# EAGLE design version02 (EAGLE 4.16)
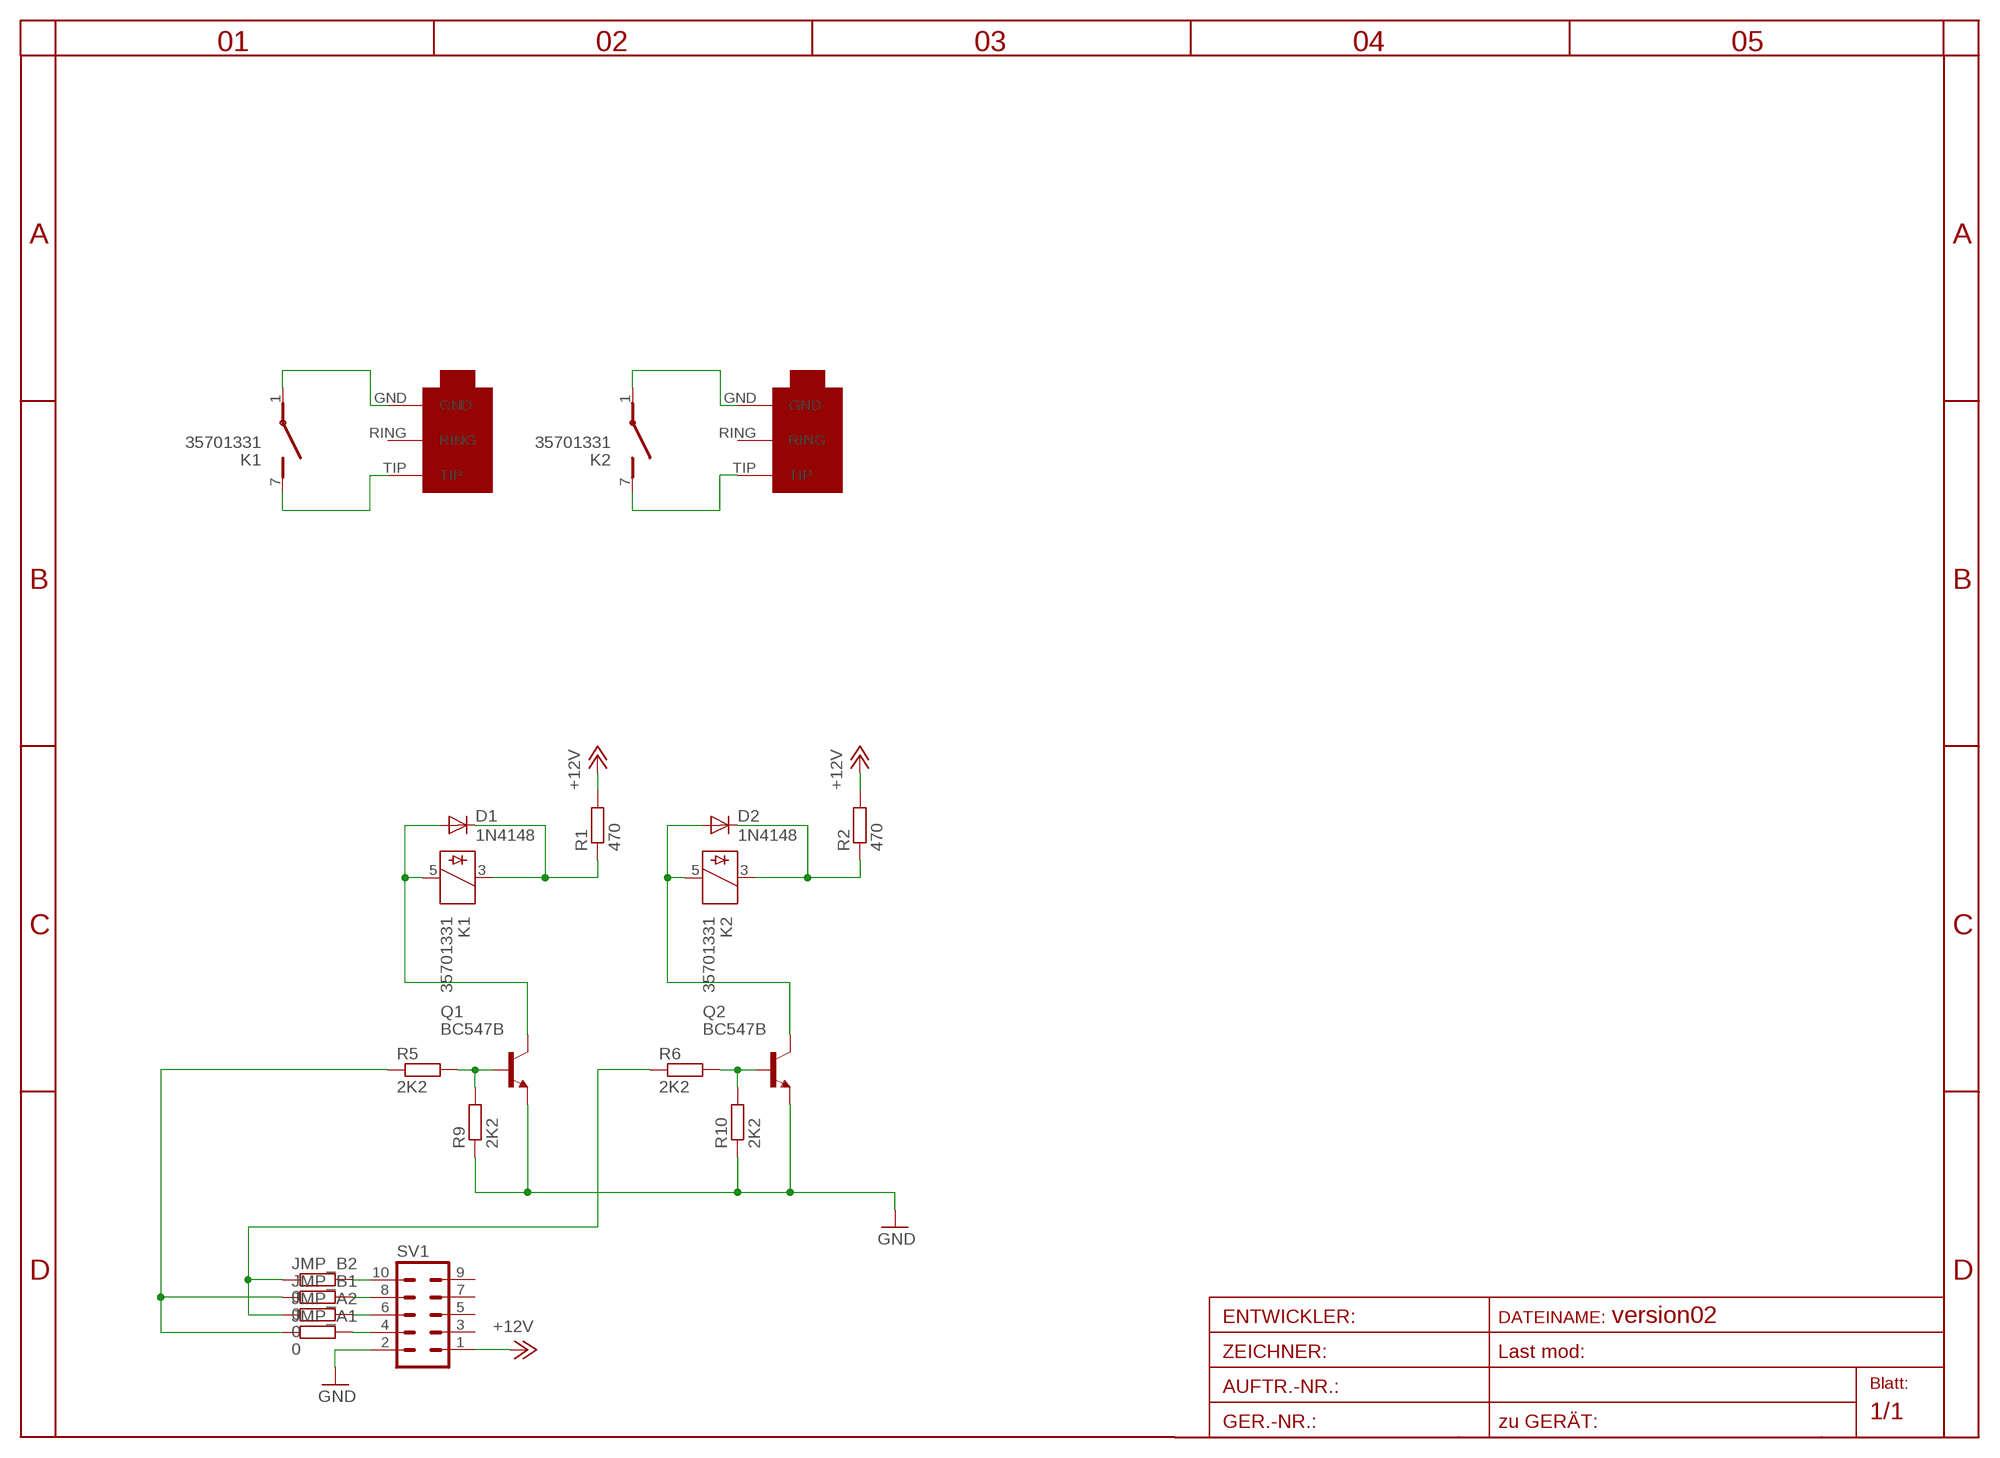
[diagram p0: schematic, sheet 1]

## Parts
D1  1N4148  [DO35-10]
D2  1N4148  [DO35-10]
JMP_A1  0  R-EU_0204/5  [0204/5]
JMP_A2  0  R-EU_0204/7  [0204/7]
JMP_B1  0  R-EU_0204/5  [0204/5]
JMP_B2  0  R-EU_0204/5  [0204/5]
K1  35701331  [REED]
K2  35701331  [REED]
Q1  BC547B  [TO92]
Q2  BC547B  [TO92]
R1  470  R-EU_0204/7  [0204/7]
R2  470  R-EU_0204/7  [0204/7]
R5  2K2  R-EU_0204/7  [0204/7]
R6  2K2  R-EU_0204/7  [0204/7]
R9  2K2  R-EU_0204/7  [0204/7]
R10  2K2  R-EU_0204/7  [0204/7]
SV1  ML10  [ML10]
U$1  3,6ERBUCHSE  [REICHELT6,3MM]
U$2  3,6ERBUCHSE  [REICHELT6,3MM]

## Nets
+12V: R1.2 R2.2 SV1.1
GND: Q1.1(E) Q2.1(E) R9.1 R10.1 SV1.2
N$1: K1.1(2:P) U$1.GND
N$2: K1.7(2:S) U$1.TIP
N$3: JMP_A1.2 SV1.4
N$4: K2.7(2:S) U$2.TIP
N$5: K2.1(2:P) U$2.GND
N$6: JMP_A2.2 SV1.6
N$7: JMP_B1.2 SV1.8
N$8: JMP_B2.2 SV1.10
N$17: D1.A K1.5 Q1.3(C)
N$18: D1.C K1.3 R1.1
N$19: D2.A K2.5 Q2.3(C)
N$20: D2.C K2.3 R2.1
N$25: Q1.2(B) R5.2 R9.2
N$26: Q2.2(B) R6.2 R10.2
N$29: JMP_A1.1 JMP_B1.1 R5.1
N$30: JMP_A2.1 JMP_B2.1 R6.1
Unconnected: SV1.3 SV1.5 SV1.7 SV1.9 U$1.RING U$2.RING

## Library data of the parts
D1 D2 = diode:1N4148: DIODE high speed (Philips)
JMP_A1 JMP_A2 JMP_B1 JMP_B2 R1 R2 R5 R6 R9 R10 = rcl:R-EU_: RESISTOR, European symbol
K1 K2 = relay:35701331: RELAY reed, 1 x norm. open with polarity
Q1 Q2 = transistor-npn:BC547*: NPN Transistor
SV1 = con-harting-custom:ML10: HARTING
U$1 U$2 = con-klinke:3,6ERBUCHSE

## Net classes
0 default: width 1.143 mm
1 N$1: width 1.27 mm

## Board
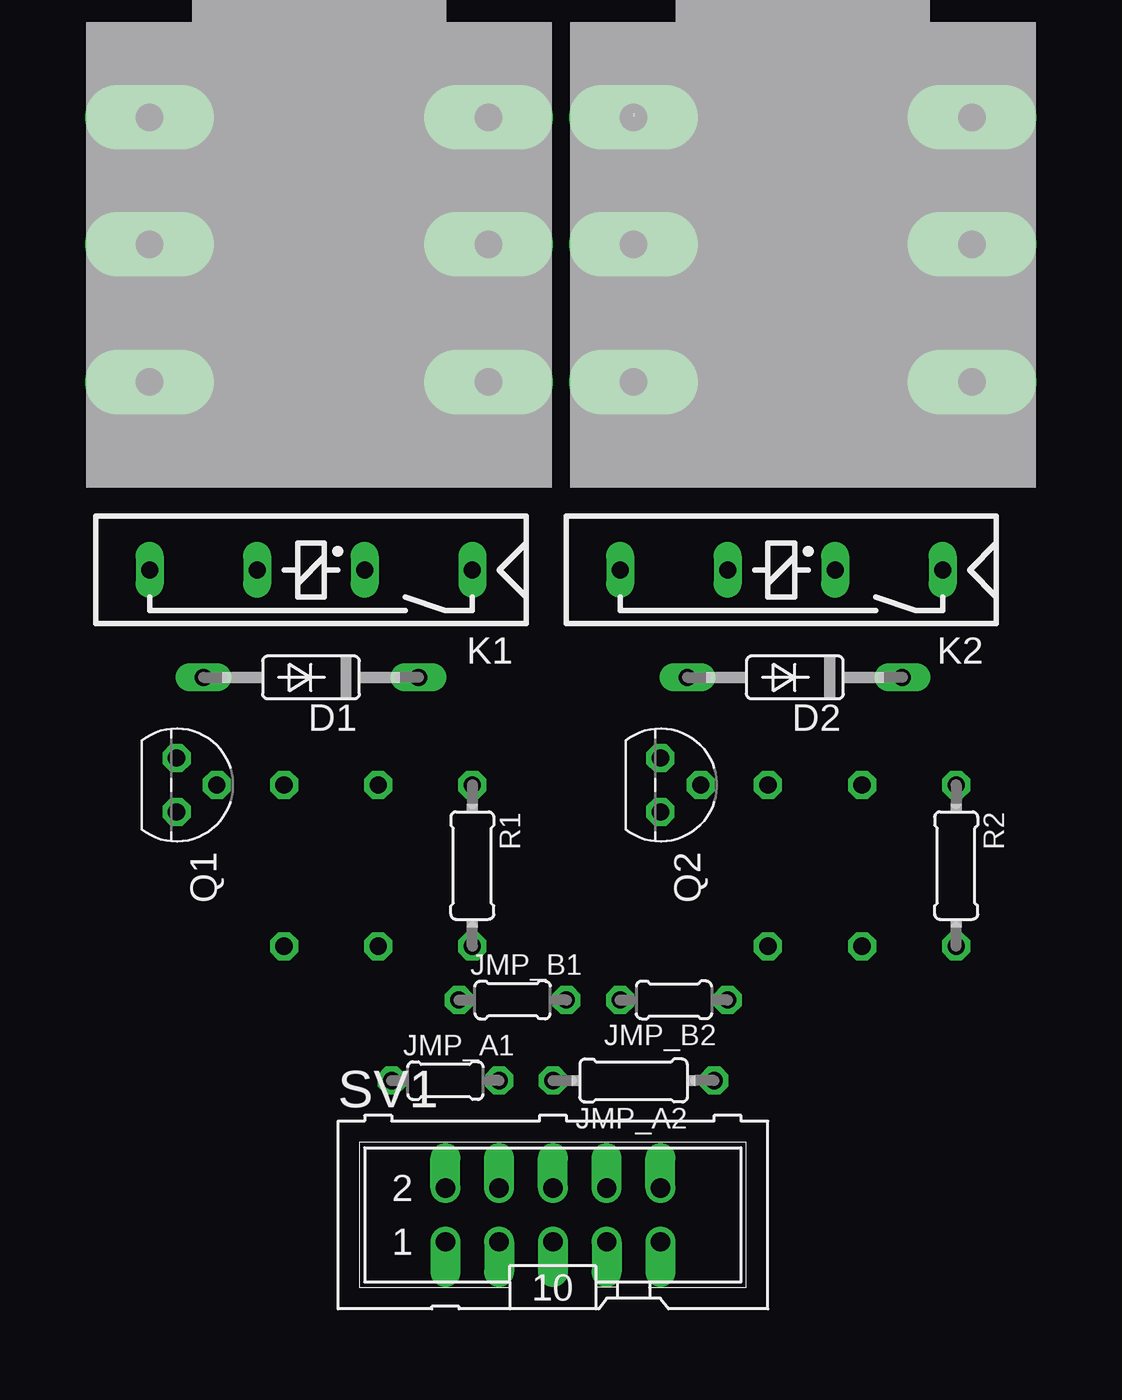
[diagram p1: board, top side]
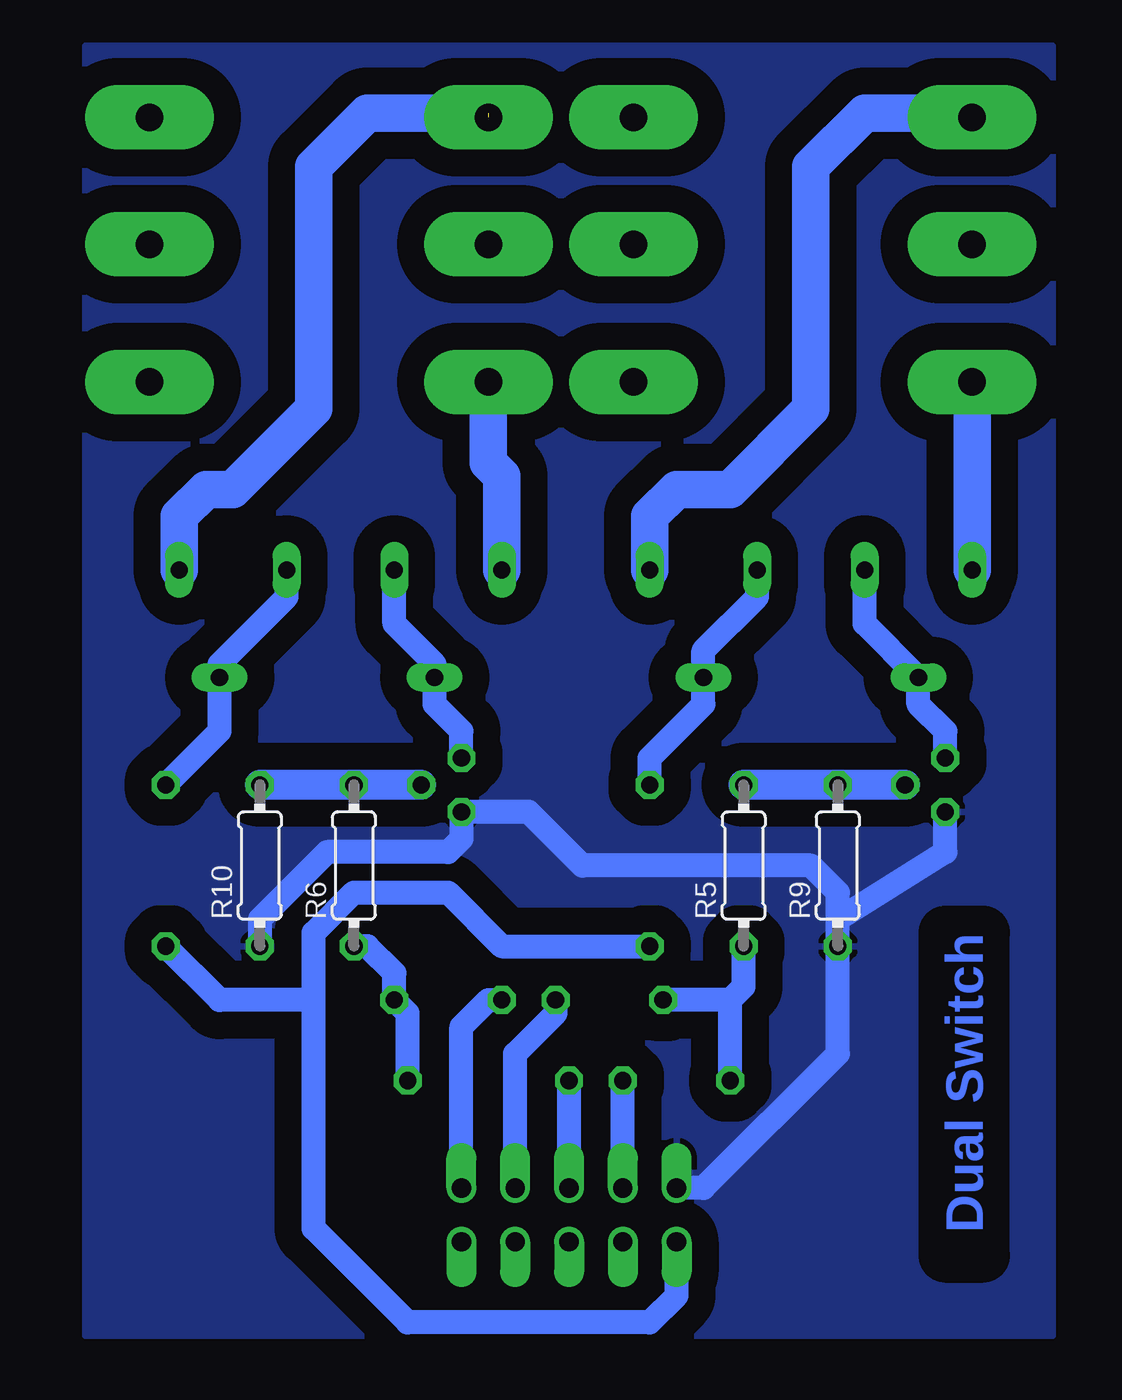
[diagram p2: board, bottom side, seen from below]

No outline drawn. Coordinates in mm, seen from the top.
Copper layers (1*16): Top 0.035mm / dielectric 1.5mm / Bottom 0.035mm
Design rules "default": minimum track width 10mil, minimum drill 24mil, track to track 8mil, track to pad 8mil, pad to pad 8mil, via to via 8mil, smd to smd 8mil, copper to edge 40mil, drill to drill 8mil, minimum pad ring 10mil, minimum via ring 8mil, stop-mask expansion 4mil, vias tented up to drill 0mil, thermal gap 10mil

### Footprints (pad centres in the part's own frame; a part is rotated, then mirrored left to right if it is on the bottom)
DO35-10 = drill 0.813 long: A 5.08,0; C -5.08,0
0204/5 = drill 0.813 octagon: 1 -2.54,0; 2 2.54,0
0204/7 = drill 0.813 octagon: 1 -3.81,0; 2 3.81,0
REED = drill 0.813 long: 1 -17.78,2.54; 3 -12.7,2.54; 5 -7.62,2.54; 7 -2.54,2.54
TO92 = drill 0.813 octagon: 1 1.27,0; 2 0,1.905; 3 -1.27,0
ML10 = drill 0.914 offset: 1 -5.08,-1.27; 2 -5.08,1.27; 3 -2.54,-1.27; 4 -2.54,1.27; 5 0,-1.27; 6 0,1.27; 7 2.54,-1.27; 8 2.54,1.27; 9 5.08,-1.27; 10 5.08,1.27
REICHELT6,3MM = drill 1.3 pad 3.048 long: GND 0,12.5; P$2 16,6.5; P$4 16,0; P$6 16,12.5; RING 0,6.5; TIP 0,0

### Placement (x,y rotation side)
D1  11.43,31.11 180 top
D2  34.29,31.11 180 top
JMP_A1  17.78,12.06 0 top
JMP_A2  26.67,12.06 180 top
JMP_B1  20.95,15.88 0 top
JMP_B2  28.57,15.88 180 top
K1  1.27,38.73 180 top
K2  23.5,38.73 180 top
Q1  5.08,26.04 270 top
Q2  27.94,26.04 270 top
R1  19.05,22.23 270 top
R2  41.91,22.23 270 top
R5  14.61,22.23 90 bottom
R6  33.02,22.23 90 bottom
R9  10.16,22.23 90 bottom
R10  37.47,22.23 90 bottom
SV1  22.86,5.71 0 top
U$1  3.81,45.09 0 top
U$2  26.67,45.09 0 top

### Tracks (layer width: path | path; a pad name or v marks a point on that pad's centre or on a via)
+12V
  Bottom 1.143: SV1.1 17.78,1.91 19.05,0.64 30.48,0.64 34.92,5.08 34.92,15.88 | R1.2 26.04,18.41 28.57,20.95 33.02,20.95 34.92,19.05 34.92,15.88 | R2.2 39.37,15.88 34.92,15.88
GND
  Bottom 1.143: 10.16,19.68 5.08,22.86 Q1.1 | R10.1 37.47,19.68 34.29,22.86 28.57,22.86 27.94,23.5 Q2.1 24.77,24.77 22.23,22.23 11.43,22.23 10.16,20.95 10.16,19.68 | 10.16,19.68 R9.1 10.16,13.34 16.51,6.99 SV1.2
  pour Bottom (isolate 1.27): 0,0 0,60.96 45.72,60.96 45.72,0
N$1
  Bottom 1.143: 3.81,57.78 U$1.GND
  Bottom 1.778: K1.1 19.05,38.73 17.78,40.01 15.24,40.01 11.43,43.81 11.43,55.24 8.89,57.78 3.81,57.78
N$2
  Bottom 1.778: K1.7 U$1.TIP
N$3
  Bottom 1.143: SV1.4 JMP_A1.2
N$4
  Bottom 1.778: K2.7 26.04,40.64 26.67,41.27 U$2.TIP
N$5  (1 unrouted)
  Bottom 1.778: K2.1 41.27,38.73 40.01,40.01 38.73,40.01 34.92,43.81 34.92,55.24 32.38,57.78 26.67,57.78
N$6
  Bottom 1.143: SV1.6 JMP_A2.2
N$7
  Bottom 1.143: SV1.8 25.4,13.34 23.5,15.24 JMP_B1.2
N$8
  Bottom 1.143: SV1.10 27.94,14.61 26.67,15.88 JMP_B2.2
N$17
  Bottom 1.143: Q1.3 5.08,28.57 6.35,29.84 D1.A 8.89,33.66 K1.5
N$18
  Bottom 1.143: D1.C 16.13,30.99 | R1.1 19.05,27.3 16.51,29.84 D1.C | D1.C 16.51,32.38 13.97,34.92 K1.3
N$19
  Bottom 1.143: Q2.3 27.94,28.57 29.21,29.84 D2.A 29.21,31.75 31.11,33.66 K2.5
N$20
  Bottom 1.143: R2.1 39.37,28.57 D2.C 39.37,31.75 36.2,34.92 K2.3
N$25
  Bottom 1.422: Q1.2 R9.2 R5.2
N$26
  Bottom 1.422: Q2.2 R6.2 R10.2
N$29
  Bottom 1.143: JMP_A1.1 15.24,15.88 | 15.24,15.88 14.61,16.51 R5.1 | 15.24,15.88 JMP_B1.1
N$30
  Bottom 1.143: JMP_A2.1 30.48,15.24 JMP_B2.1 31.11,17.14 32.38,18.41 R6.1

### Text on the board
Bottom: Dual Switch